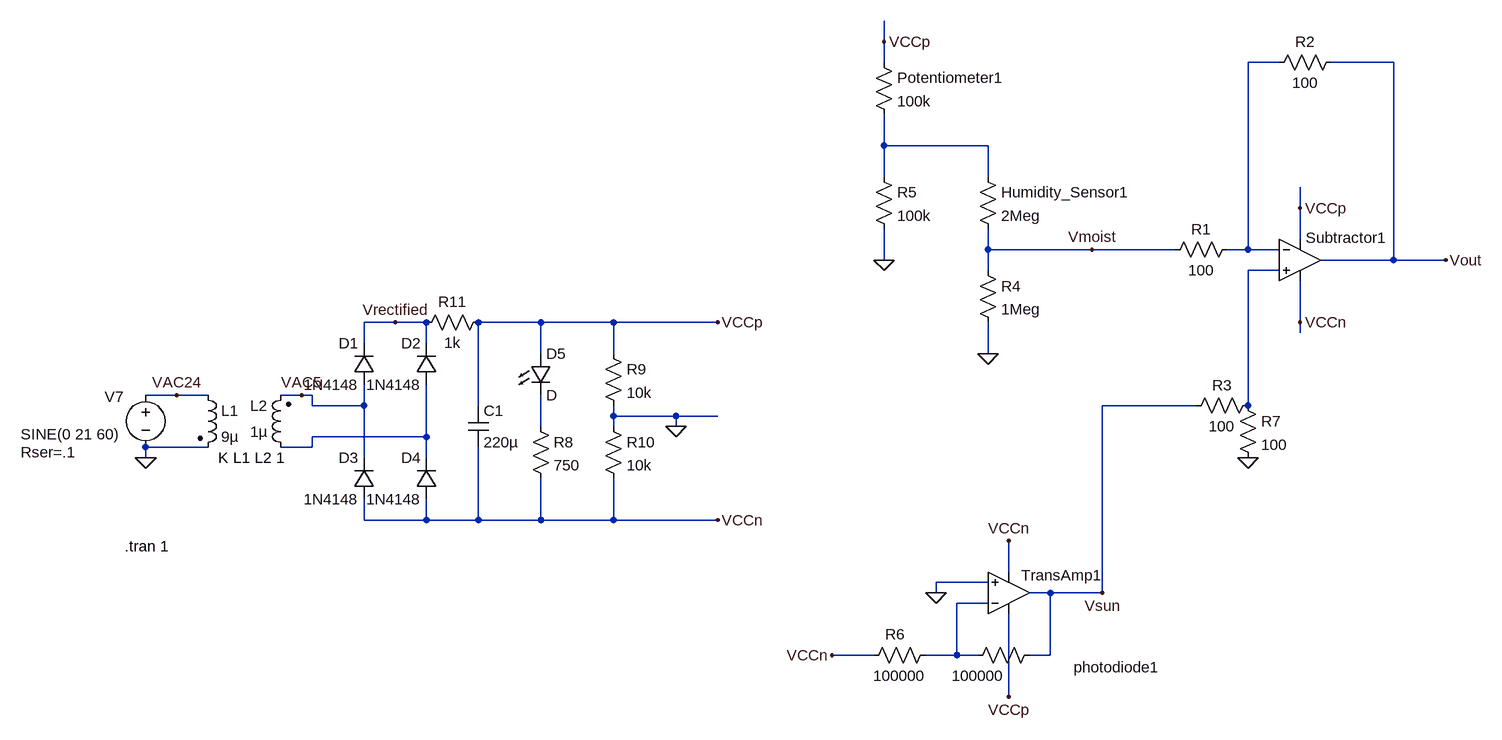
[diagram p0: schematic Omega3combined.asc]
Omega3combined.asc, the LTspice schematic file:
Version 4
SHEET 1 880 804
WIRE -192 -320 -192 -352
WIRE -192 -288 -192 -320
WIRE 416 -288 368 -288
WIRE 592 -288 496 -288
WIRE -192 -160 -192 -208
WIRE -32 -160 -192 -160
WIRE -192 -112 -192 -160
WIRE -32 -112 -32 -160
WIRE 448 -64 448 -96
WIRE 448 -16 448 -64
WIRE -32 0 -32 -32
WIRE 128 0 -32 0
WIRE 256 0 128 0
WIRE 368 0 368 -288
WIRE 368 0 336 0
WIRE 416 0 368 0
WIRE -192 16 -192 -32
WIRE 592 16 592 -288
WIRE 592 16 480 16
WIRE 672 16 592 16
WIRE -32 32 -32 0
WIRE 416 32 368 32
WIRE -944 112 -992 112
WIRE -896 112 -944 112
WIRE -720 112 -816 112
WIRE -608 112 -720 112
WIRE -448 112 -608 112
WIRE 448 112 448 48
WIRE 448 128 448 112
WIRE -992 144 -992 112
WIRE -896 144 -896 112
WIRE -720 160 -720 112
WIRE -608 160 -608 112
WIRE -32 160 -32 112
WIRE -1280 224 -1328 224
WIRE -1232 224 -1280 224
WIRE -1088 224 -1120 224
WIRE -1072 224 -1088 224
WIRE -1072 240 -1072 224
WIRE -992 240 -992 208
WIRE -992 240 -1072 240
WIRE -816 240 -816 112
WIRE 288 240 144 240
WIRE 368 240 368 32
WIRE -608 256 -608 240
WIRE -512 256 -608 256
WIRE -448 256 -512 256
WIRE -720 272 -720 224
WIRE -608 272 -608 256
WIRE -512 272 -512 256
WIRE -896 288 -896 208
WIRE -896 288 -1072 288
WIRE -1232 304 -1328 304
WIRE -1072 304 -1072 288
WIRE -1072 304 -1120 304
WIRE -1328 320 -1328 304
WIRE -992 320 -992 240
WIRE -896 320 -896 288
WIRE -992 416 -992 384
WIRE -896 416 -896 384
WIRE -896 416 -992 416
WIRE -816 416 -816 304
WIRE -816 416 -896 416
WIRE -720 416 -720 352
WIRE -720 416 -816 416
WIRE -608 416 -608 352
WIRE -608 416 -720 416
WIRE -448 416 -608 416
WIRE 0 496 0 448
WIRE -32 512 -112 512
WIRE -112 528 -112 512
WIRE 64 528 32 528
WIRE 144 528 144 240
WIRE 144 528 64 528
WIRE -32 544 -80 544
WIRE -208 624 -272 624
WIRE -80 624 -80 544
WIRE -80 624 -128 624
WIRE -48 624 -80 624
WIRE 64 624 64 528
WIRE 64 624 32 624
WIRE 0 688 0 560
FLAG 672 16 Vout
FLAG -192 16 0
FLAG -32 160 0
FLAG -112 528 0
FLAG 368 320 0
FLAG 144 528 Vsun
FLAG 128 0 Vmoist
FLAG -1088 224 VAC5
FLAG -944 112 Vrectified
FLAG -512 272 0
FLAG -1328 320 0
FLAG -1280 224 VAC24
FLAG -448 112 VCCp
FLAG -448 416 VCCn
FLAG 0 688 VCCp
FLAG 448 -64 VCCp
FLAG -192 -320 VCCp
FLAG -272 624 VCCn
FLAG 0 448 VCCn
FLAG 448 112 VCCn
SYMBOL res 352 -16 R90
WINDOW 0 0 56 VBottom 2
WINDOW 3 32 56 VTop 2
SYMATTR InstName R1
SYMATTR Value 100
SYMBOL OpAmps\\UniversalOpAmp2 448 16 R0
WINDOW 0 9 -34 Left 2
SYMATTR InstName Subtractor1
SYMBOL res 512 -304 R90
WINDOW 0 0 56 VBottom 2
WINDOW 3 32 56 VTop 2
SYMATTR InstName R2
SYMATTR Value 100
SYMBOL res 384 224 R90
WINDOW 0 0 56 VBottom 2
WINDOW 3 32 56 VTop 2
SYMATTR InstName R3
SYMATTR Value 100
SYMBOL res -48 -128 R0
SYMATTR InstName Humidity_Sensor1
SYMATTR Value 2Meg
SYMBOL res -208 -304 R0
SYMATTR InstName Potentiometer1
SYMATTR Value 100k
SYMBOL res -48 16 R0
SYMATTR InstName R4
SYMATTR Value 1Meg
SYMBOL res -208 -128 R0
SYMATTR InstName R5
SYMATTR Value 100k
SYMBOL res -112 608 R90
WINDOW 0 -1 63 VBottom 2
WINDOW 3 32 56 VTop 2
SYMATTR InstName R6
SYMATTR Value 100000
SYMBOL res 48 608 R90
WINDOW 0 50 -119 VBottom 2
WINDOW 3 32 95 VTop 2
SYMATTR InstName photodiode1
SYMATTR Value 100000
SYMBOL OpAmps\\UniversalOpAmp2 0 528 M180
WINDOW 0 19 27 Left 2
SYMATTR InstName TransAmp1
SYMBOL res 352 224 R0
SYMATTR InstName R7
SYMATTR Value 100
SYMBOL voltage -1328 208 R0
WINDOW 0 -63 18 Left 2
WINDOW 3 -192 76 Left 2
WINDOW 123 0 0 Left 0
WINDOW 39 -192 104 Left 2
SYMATTR InstName V7
SYMATTR Value SINE(0 21 60)
SYMATTR SpiceLine Rser=.1
SYMBOL diode -976 208 R180
WINDOW 0 24 64 Left 2
WINDOW 3 24 0 Left 2
SYMATTR InstName D1
SYMATTR Value 1N4148
SYMBOL diode -880 208 R180
WINDOW 0 24 64 Left 2
WINDOW 3 24 0 Left 2
SYMATTR InstName D2
SYMATTR Value 1N4148
SYMBOL diode -976 384 R180
WINDOW 0 24 64 Left 2
WINDOW 3 24 0 Left 2
SYMATTR InstName D3
SYMATTR Value 1N4148
SYMBOL diode -880 384 R180
WINDOW 0 24 64 Left 2
WINDOW 3 24 0 Left 2
SYMATTR InstName D4
SYMATTR Value 1N4148
SYMBOL cap -832 240 R0
SYMATTR InstName C1
SYMATTR Value 220µ
SYMBOL LED -736 160 R0
SYMATTR InstName D5
SYMBOL res -736 256 R0
SYMATTR InstName R8
SYMATTR Value 750
SYMBOL ind2 -1248 208 R0
SYMATTR InstName L1
SYMATTR Value 9µ
SYMATTR Type ind
SYMBOL ind2 -1104 320 R180
WINDOW 0 36 80 Left 2
WINDOW 3 36 40 Left 2
SYMATTR InstName L2
SYMATTR Value 1µ
SYMATTR Type ind
SYMBOL res -624 144 R0
SYMATTR InstName R9
SYMATTR Value 10k
SYMBOL res -624 256 R0
SYMATTR InstName R10
SYMATTR Value 10k
SYMBOL res -800 96 R90
WINDOW 0 0 56 VBottom 2
WINDOW 3 32 56 VTop 2
SYMATTR InstName R11
SYMATTR Value 1k
TEXT -1360 456 Left 2 !.tran 1
TEXT -1216 320 Left 2 !K L1 L2 1

The netlist it stands for:
* Omega3combined.asc
R1 N001 Vmoist 100
XSubtractor1 N003 N001 VCCp VCCn Vout level2 Avol=1Meg GBW=10Meg Slew=10Meg Ilimit=25m Rail=0 Vos=0 En=0 Enk=0 In=0 Ink=0 Rin=500Meg  ; pins In+ In- V+ V- OUT
R2 Vout N001 100
R3 N003 Vsun 100
R§Humidity_Sensor1 N002 Vmoist 2Meg
R§Potentiometer1 VCCp N002 100k
R4 Vmoist 0 1Meg
R5 N002 0 100k
R6 N006 VCCn 100000
R§photodiode1 Vsun N006 100000
XTransAmp1 0 N006 VCCp VCCn Vsun level2 Avol=1Meg GBW=10Meg Slew=10Meg Ilimit=25m Rail=0 Vos=0 En=0 Enk=0 In=0 Ink=0 Rin=500Meg  ; pins In+ In- V+ V- OUT
R7 N003 0 100
V7 VAC24 0 SINE(0 21 60) Rser=.1
D1 VAC5 Vrectified 1N4148
D2 N005 Vrectified 1N4148
D3 VCCn VAC5 1N4148
D4 VCCn N005 1N4148
C1 VCCp VCCn 220µ
D5 VCCp N004 D
R8 N004 VCCn 750
L1 VAC24 0 9µ
L2 N005 VAC5 1µ
R9 VCCp 0 10k
R10 0 VCCn 10k
R11 VCCp Vrectified 1k
.model D D
.lib standard.dio
.tran 1
K L1 L2 1
.lib UniversalOpAmp2.lib
.backanno
.end